# Altium schematic sheet SiLPA_HE_PA_Supply.SchDoc: SiLPA HE
size 420 x 297 mm; EDA_Number: ARTIQ; Projet: ARTIQ/SINARA; Author: S.Hanasz / G. Kasprowicz; CompanyName: WUT ISE; DrawnBy: S.Hanasz / G. Kasprowicz; Organization: WUT ISE; Address1: PW ISE; Address2: Nowowiejska 15/19 00-665 Warsaw; Address3: gkasprow@gmail.com; DocumentNumber: 5; Revision: 1; SheetNumber: 5; SheetTotal: 9; ModifiedBy: -; CheckedDate: -; Title2: PA Power supply; DivGrp: WUT ISE; Designer: S.Hanasz / G. Kasprowicz; ModifiedDate: -; ProjectName: Sensor Box
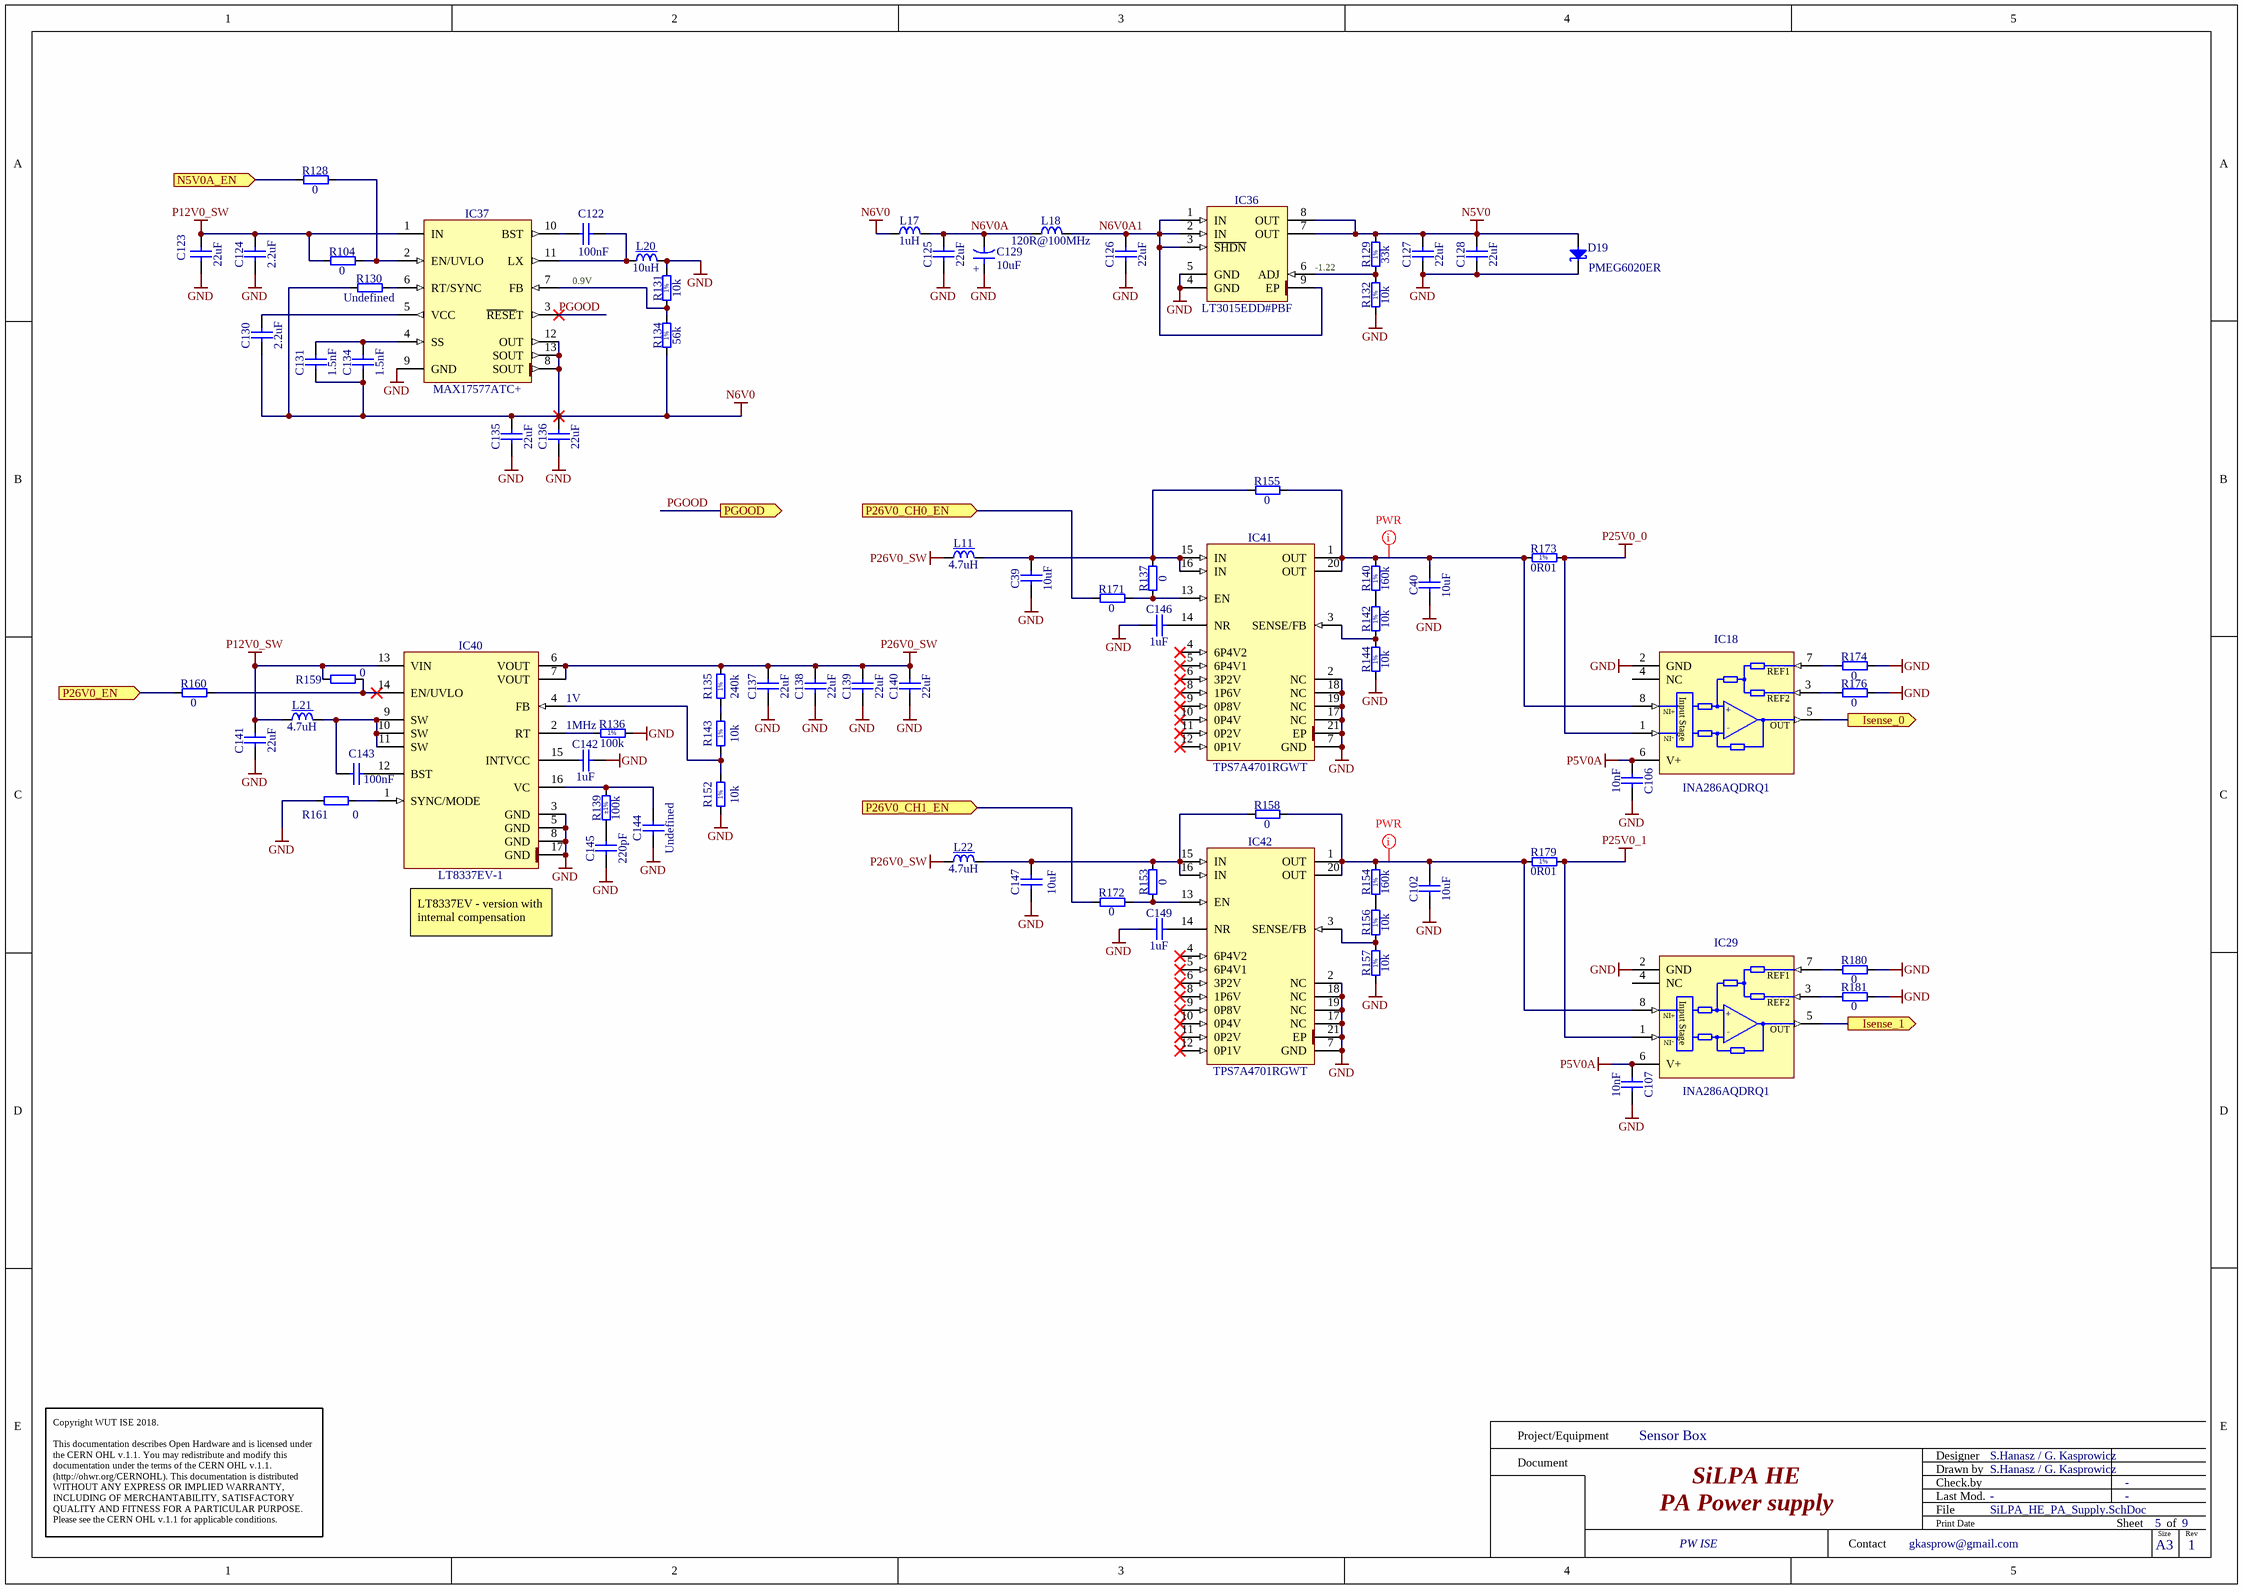
[diagram p0: SiLPA_HE_PA_Supply.SchDoc]

## Parts
C39  10uF  [CAPC3225X280N]
C40  10uF  [CAPC3225X280N]
C102  10uF  [CAPC3225X280N]
C106  10nF  [CAPC1005X55N]
C107  10nF  [CAPC1005X55N]
C122  100nF  [CAPC1005X55N]
C123  22uF  [CAPC3216X180N]
C124  2.2uF  [CAPC1608X87N]
C125  22uF  [CAPC2012X135N]
C126  22uF  [CAPC2012X135N]
C127  22uF  [CAPC2012X135N]
C128  22uF  [CAPC2012X135N]
C129  10uF  [CAPMP3216X180N]
C130  2.2uF  [CAPC1608X87N]
C131  1.5nF  [CAPC1005X55N]
C134  1.5nF  [CAPC1005X55N]
C135  22uF  [CAPC2012X135N]
C136  22uF  [CAPC2012X135N]
C137  22uF  [CAPC3216X180N]
C138  22uF  [CAPC3216X180N]
C139  22uF  [CAPC3216X180N]
C140  22uF  [CAPC3216X180N]
C141  22uF  [CAPC3216X180N]
C142  1uF  [CAPC1608X87N]
C143  100nF  [CAPC1005X55N]
C144  Undefined  [CAPC1005X55N]
C145  220pF  [CAPC1005X55N]
C146  1uF  [CAPC1608X87N]
C147  10uF  [CAPC3225X280N]
C149  1uF  [CAPC1608X87N]
D19  PMEG6020ER  [SODFL3517X110N]
IC18  INA286AQDRQ1  [SOIC127P600X175-8N]
IC29  INA286AQDRQ1  [SOIC127P600X175-8N]
IC36  LT3015EDD#PBF  [SON50P300X300X80-9N-R175X248]
IC37  MAX17577ATC+  [SON50P300X300X80-13N-R180X260]
IC40  LT8337EV-1  [ANALOG-DEVICES_LQFN(16) # 05-08-1798]
IC41  TPS7A4701RGWT  [QFN65P500X500X100-21N-S325]
IC42  TPS7A4701RGWT  [QFN65P500X500X100-21N-S325]
L11  4.7uH  [IND_WURTH_WE-SPC-4838]
L17  1uH  [INDC2620X100N]
L18  120R@100MHz  [INDC1608X65N]
L20  10uH  [IND_WURTH_WE-SPC-4838]
L21  4.7uH  [IND_WURTH_WE-SPC-4838]
L22  4.7uH  [IND_WURTH_WE-SPC-4838]
R104  0  [RESC1005X40N]
R128  0  [RESC1005X40N]
R129  33k  [RESC1005X40N]
R130  Undefined  [RESC1005X40N]
R131  10k  [RESC1005X40N]
R132  10k  [RESC1005X40N]
R134  56k  [RESC1005X40N]
R135  240k  [RESC1005X40N]
R136  100k  [RESC1005X40N]
R137  0  [RESC1608X55N]
R139  100k  Tolerance: ±1%  [RESC1005X40N]
R140  160k  [RESC1005X40N]
R142  10k  [RESC1005X40N]
R143  10k  [RESC1005X40N]
R144  10k  [RESC1005X40N]
R152  10k  [RESC1005X40N]
R153  0  [RESC1608X55N]
R154  160k  [RESC1005X40N]
R155  0  [RESC3216X65N]
R156  10k  [RESC1005X40N]
R157  10k  [RESC1005X40N]
R158  0  [RESC3216X65N]
R159  0  [RESC1005X40N]
R160  0  [RESC1005X40N]
R161  0  [RESC1005X40N]
R171  0  [RESC1608X55N]
R172  0  [RESC1608X55N]
R173  0R01  [RES_BOURNS_CFG0612]
R174  0  [RESC1005X40N]
R176  0  [RESC1005X40N]
R179  0R01  [RES_BOURNS_CFG0612]
R180  0  [RESC1005X40N]
R181  0  [RESC1005X40N]

## Ports
Isense_0 (out), Isense_1 (out), N5V0A_EN (in), P26V0_CH0_EN (in), P26V0_CH1_EN (in), P26V0_EN (in), PGOOD (out)

## Nets
GND: C39.1 C40.1 C102.1 C106.2 C107.2 C123.1 C124.1 C125.1 C126.1 C127.1 C128.1 C129.1 C135.1 C136.1 C137.1 C138.1 C139.1 C140.1 C141.1 C142.2 C144.1 C145.1 C146.1 C147.1 C149.1 D19.1(C) IC18.2(GND) IC29.2(GND) IC36.4(GND) IC36.5(GND) IC37.9(GND) IC40.3(GND) IC40.5(GND) IC40.8(GND) IC40.17(GND) IC41.2(NC) IC41.7(GND) IC41.17(NC) IC41.18(NC) IC41.19(NC) IC41.21(EP) IC42.2(NC) IC42.7(GND) IC42.17(NC) IC42.18(NC) IC42.19(NC) IC42.21(EP) L20.2 R131.2 R132.1 R136.2 R144.1 R152.1 R157.1 R161.1 R174.2 R176.2 R180.2 R181.2
N5V0: C127.2 C128.2 D19.2(A) IC36.7(OUT) IC36.8(OUT) R129.2
N6V0: C130.1 C131.1 C134.1 C135.2 C136.2 IC37.8(SOUT) IC37.12(OUT) IC37.13(SOUT) L17.1 R130.1 R134.1
P5V0A: C106.1 C107.1 IC18.6(V+) IC29.6(V+)
P12V0_SW: C123.2 C124.2 C141.2 IC37.1(IN) IC40.13(VIN) L21.1 R104.1 R159.1
P25V0_0: IC18.1(-IN) R173.2
P25V0_1: IC29.1(-IN) R179.2
P26V0_SW: C137.2 C138.2 C139.2 C140.2 IC40.6(VOUT) IC40.7(VOUT) L11.1 L22.1 R135.2
Isense_0: IC18.5(OUT) ; port Isense_0
Isense_1: IC29.5(OUT) ; port Isense_1
N5V0A_EN: R128.1 ; port N5V0A_EN
N6V0A: C125.2 C129.2 L17.2 L18.1
N6V0A1: C126.2 IC36.1(IN) IC36.2(IN) IC36.3(~{SHDN}) IC36.9(EP) L18.2
P26V0_CH0_EN: R171.1 ; port P26V0_CH0_EN
P26V0_CH1_EN: R172.1 ; port P26V0_CH1_EN
P26V0_EN: R160.1 ; port P26V0_EN
PGOOD: IC37.3(~{RESE}T) ; port PGOOD
NetC39_2: C39.2 IC41.15(IN) IC41.16(IN) L11.2 R137.2 R155.1
NetC40_2: C40.2 IC18.8(+IN) IC41.1(OUT) IC41.20(OUT) R140.2 R155.2 R173.1
NetC102_2: C102.2 IC29.8(+IN) IC42.1(OUT) IC42.20(OUT) R154.2 R158.2 R179.1
NetC122_1: C122.1 IC37.11(LX) L20.1
NetC122_2: C122.2 IC37.10(BST)
NetC130_2: C130.2 IC37.5(VCC)
NetC131_2: C131.2 C134.2 IC37.4(SS)
NetC142_1: C142.1 IC40.15(INTVCC)
NetC143_1: C143.1 IC40.12(BST)
NetC143_2: C143.2 IC40.9(SW) IC40.10(SW) IC40.11(SW) L21.2
NetC144_2: C144.2 IC40.16(VC) R139.2
NetC145_2: C145.2 R139.1
NetC146_2: C146.2 IC41.14(NR)
NetC147_2: C147.2 IC42.15(IN) IC42.16(IN) L22.2 R153.2 R158.1
NetC149_2: C149.2 IC42.14(NR)
NetIC18_3: IC18.3(REF2) R176.1
NetIC18_7: IC18.7(REF1) R174.1
NetIC29_3: IC29.3(REF2) R181.1
NetIC29_7: IC29.7(REF1) R180.1
NetIC36_6: IC36.6(ADJ) R129.1 R132.2
NetIC37_2: IC37.2(EN/UVLO) R104.2 R128.2
NetIC37_6: IC37.6(RT/SYNC) R130.2
NetIC37_7: IC37.7(FB) R131.1 R134.2
NetIC40_1: IC40.1(SYNC/MODE) R161.2
NetIC40_2: IC40.2(RT) R136.1
NetIC40_4: IC40.4(FB) R143.1 R152.2
NetIC40_14: IC40.14(EN/UVLO) R159.2 R160.2
NetIC41_3: IC41.3(SENSE/FB) R142.1 R144.2
NetIC41_13: IC41.13(EN) R137.1 R171.2
NetIC42_3: IC42.3(SENSE/FB) R156.1 R157.2
NetIC42_13: IC42.13(EN) R153.1 R172.2
NetR135_1: R135.1 R143.2
NetR140_1: R140.1 R142.2
NetR154_1: R154.1 R156.2

Not connected (* = marked no-connect by the designer): IC18 4(NC); IC29 4(NC); IC41 4(6P4V2)* 5(6P4V1)* 6(3P2V)* 8(1P6V)* 9(0P8V)* 10(0P4V)* 11(0P2V)* 12(0P1V)*; IC42 4(6P4V2)* 5(6P4V1)* 6(3P2V)* 8(1P6V)* 9(0P8V)* 10(0P4V)* 11(0P2V)* 12(0P1V)*

## Layout directives
net class PWR: NetC40_2, NetC102_2

## Notes on the sheet
- 0.9V
- -1.22
- 1V
- (near R136) 1MHz
- (near IC40) LT8337EV - version with internal compensation
- Project/Equipment
- Document
- Designer
- Drawn by
- Check.by
- Copyright WUT ISE 2018.
  This documentation describes Open Hardware and is licensed under the CERN OHL v.1.1. You may redistribute and modify this documentation under the terms of the CERN OHL v.1.1. (http://ohwr.org/CERNOHL). This documentation is distributed WITHOUT ANY EXPRESS OR IMPLIED WARRANTY, INCLUDING OF MERCHANTABILITY, SATISFACTORY QUALITY AND FITNESS FOR A PARTICULAR PURPOSE. Please see the CERN OHL v.1.1 for applicable conditions.
- Contact
- File
- Last Mod.
- Print Date
- Sheet
- Size
- A3
- of
- Rev
- (in symbol CTE3216-18_10UF_16V_20%_AVX_TCJ) +
- (in symbol INA286AQDRQ1) +; Input Stage; -
- (in symbol R0402_10K_1%_0.0625W_100PPM) 1%
- (in symbol R0402_33K_1%_0.0625W_100PPM) 1%
- (in symbol R0402_56K_1%_0.0625W_100PPM) 1%
- (in symbol R0402_100K_1%_0.0625W_100PPM) 1%
- (in symbol R0402_160K_1%_0.0625W_100PPM) 1%
- (in symbol R0402_240K_1%_0.0625W_100PPM) 1%
- (in symbol R0612_0R01_1%_1W_100PPM_BOURNS_CFG0612) 1%

## Library data of the parts
C39 C40 C102 C147 = CC1210_10UF_50V_10%_X7R_YUDEN_UMK325AB7106KMHP: Non-polarised capacitor; Part Description: SMD Multilayer Chip Ceramic Capacitor (High Dielectric Type) for Automotive / Industrial Applications; Manufacturer: TAIYO YUDEN; Voltage: 50V; TC: X7R; Tolerance: ±10%; Part Number: CC1210_10UF_50V_10%_X7R_YUDEN_UMK325AB7106KMHP; Component Kind: Standard; Component Type: Standard; Pin Count: 2; Value: 10uF; Status: Not Recommended; Manufacturer Part Number: UMK325AB7106KMHP; Case: 1210; Mounted: Yes; Socket: No; SMD: Yes; Sense: No; HelpURL: \\cern.ch\dfs\Applications\Altium\Datasheets\CC1210_TAIYO-YUDEN_UMK325AB7106KMHP.pdf; Author: CERN DEM JLC; CreateDate: 30.11.2016; LatestRevisionDate: 30.12.2015; ComponentHeight: 2.8mm
C106 C107 = CC0402_10NF_16V_10%_X7R: Non-polarised capacitor; Part Description: SMD Multilayer Chip Ceramic Capacitor; Manufacturer: GENERIC; Manufacturer1 Part Number: 223878715636; Voltage: 16V; TC: X7R; Tolerance: ±10%; Part Number: CC0402_10NF_16V_10%_X7R; Component Kind: Standard; Component Type: Standard; Pin Count: 2; Value: 10nF; Status: Not Recommended; Manufacturer Part Number: CC0402_10NF_16V_10%_X7R; Case: 0402; Mounted: Yes; Socket: No; SMD: Yes; Manufacturer1 Example: PHYCOMP; Manufacturer1 ComponentHeight: 0.55mm; HelpURL: \\cern.ch\dfs\Applications\Altium\Datasheets\CC0402_X7R_PHYCOMP.pdf; Author: CERN DEM JLC; CreateDate: 03.12.2007; LatestRevisionDate: 03.12.2007; Sense: No
C122 C143 = CC0402_100NF_16V_10%_X5R: Non-polarised capacitor; Part Description: SMD Multilayer Chip Ceramic Capacitor; Manufacturer: GENERIC; Manufacturer1 Part Number: GRM155R61C104KA88D; Voltage: 16V; TC: X5R; Tolerance: ±10%; Part Number: CC0402_100NF_16V_10%_X5R; Component Kind: Standard; Component Type: Standard; Pin Count: 2; Value: 100nF; Status: None; Manufacturer Part Number: CC0402_100NF_16V_10%_X5R; Case: 0402; Mounted: Yes; Socket: No; SMD: Yes; Sense: No; Manufacturer1 Example: MURATA; Manufacturer1 ComponentHeight: 0.55mm; HelpURL: \\cern.ch\dfs\Applications\Altium\Datasheets\CC0402_X5R_MURATA_GRM.pdf; Author: CERN DEM JLC; CreateDate: 10.12.2013; LatestRevisionDate: 10.12.2013
C123 C137-C141 = CC1206_22UF_35V_20%_JB_TDK_C3216JB1V226M160AC: Non-polarised capacitor; Part Description: SMD Multilayer Chip Ceramic Capacitor; Manufacturer: TDK; Voltage: 35V; TC: JB(±10%); Tolerance: ±20%; Part Number: CC1206_22UF_35V_20%_JB_TDK_C3216JB1V226M160AC; Component Kind: Standard; Component Type: Standard; Pin Count: 2; Value: 22uF; Status: None; Manufacturer Part Number: C3216JB1V226M160AC; Case: 1206; Mounted: Yes; Socket: No; SMD: Yes; Sense: No; HelpURL: \\cern.ch\dfs\Applications\Altium\Datasheets\CC1206_TDK_C3216JB1V226M160AC.pdf; Author: CERN DEM JLC; CreateDate: 13.07.2017; LatestRevisionDate: 13.07.2017; ComponentHeight: 1.8mm
C124 C130 = CC0603_2.2UF_16V_10%_X5R: Non-polarised capacitor; Part Description: SMD Multilayer Chip Ceramic Capacitor; Manufacturer: GENERIC; Manufacturer1 Part Number: CC0603KRX5R7BB225; Voltage: 16V; TC: X5R; Tolerance: ±10%; Part Number: CC0603_2.2UF_16V_10%_X5R; Component Kind: Standard; Component Type: Standard; Pin Count: 2; Value: 2.2uF; Status: Preferred; Manufacturer Part Number: CC0603_2.2UF_16V_10%_X5R; Case: 0603; Mounted: Yes; Socket: No; SMD: Yes; Sense: No; Manufacturer1 Example: YAGEO PHYCOMP; Manufacturer1 ComponentHeight: 0.9mm; HelpURL: \\cern.ch\dfs\Applications\Altium\Datasheets\CC0805_X5R_PHYCOMP_HC.pdf; Author: CERN DEM JLC; CreateDate: 28.04.2011; LatestRevisionDate: 28.04.2011
C125-C128 C135 C136 = CC0805_22UF_16V_10%_X5R: Non-polarised capacitor; Part Description: SMD Multilayer Chip Ceramic Capacitor; Manufacturer: GENERIC; Manufacturer1 Part Number: C2012X5R1C226KT; Voltage: 16V; TC: X5R; Tolerance: ±10%; Part Number: CC0805_22UF_16V_10%_X5R; Component Kind: Standard; Component Type: Standard; Pin Count: 2; Value: 22uF; Status: Preferred; Manufacturer Part Number: CC0805_22UF_16V_10%_X5R; Case: 0805; Mounted: Yes; Socket: No; SMD: Yes; Sense: No; Manufacturer1 Example: TDK; Manufacturer1 ComponentHeight: 1.35mm; HelpURL: \\cern.ch\dfs\Applications\Altium\Datasheets\CC0805_X5R_TDK_C.pdf; Author: CERN DEM JLC; CreateDate: 25.10.2012; LatestRevisionDate: 25.10.2012
C129 = CTE3216-18_10UF_16V_20%_AVX_TCJ: Polarised capacitor; Part Description: ESR 0R200 Tantalum Solid Electrolytic Chip Capacitor with Conductive Polymer Electrode; Manufacturer: AVX; Manufacturer Part Number: TCJA106M016R0200; Voltage: 16V; Tolerance: ±20%; Part Number: CTE3216-18_10UF_16V_20%_AVX_TCJ; Component Kind: Standard; Component Type: Standard; Pin Count: 2; Value: 10uF; Status: Preferred; Case: A; Mounted: Yes; Socket: No; SMD: Yes; Sense: No; ComponentHeight: 1.8mm; HelpURL: \\cern.ch\dfs\Applications\Altium\Datasheets\CTE_AVX_TCJ.pdf; Author: CERN DEM JLC; CreateDate: 29.03.2012; LatestRevisionDate: 29.03.2012
C131 C134 = CC0402_1.5NF_50V_5%_C0G: Non-polarised capacitor; Part Description: SMD Multilayer Chip Ceramic Capacitor; Manufacturer: GENERIC; Manufacturer1 Part Number: C0402C152J5GACTU; Voltage: 50V; TC: C0G/NP0; Tolerance: ±5%; Part Number: CC0402_1.5NF_50V_5%_C0G; Component Kind: Standard; Component Type: Standard; Pin Count: 2; Value: 1.5nF; Status: Preferred; Manufacturer Part Number: CC0402_1.5NF_50V_5%_C0G; Case: 0402; Mounted: Yes; Socket: No; SMD: Yes; Sense: No; Manufacturer1 Example: KEMET; Manufacturer1 ComponentHeight: 0.55mm; HelpURL: \\cern.ch\dfs\Applications\Altium\Datasheets\CC0402_C0G_KEMET_(Commercial Grade).pdf; Author: CERN DEM BC; CreateDate: 02.09.2019; LatestRevisionDate: 02.09.2019
C142 C146 C149 = CC0603_1UF_16V_10%_X7R: Non-polarised capacitor; Part Description: SMD Multilayer Chip Ceramic Capacitor; Manufacturer: GENERIC; Manufacturer1 Part Number: 223878615663; Voltage: 16V; TC: X7R; Tolerance: ±10%; Part Number: CC0603_1UF_16V_10%_X7R; Component Kind: Standard; Component Type: Standard; Pin Count: 2; Value: 1uF; Status: None; Case: 0603; Mounted: Yes; Socket: No; SMD: Yes; Sense: No; Manufacturer1 Example: YAGEO PHYCOMP; Manufacturer1 ComponentHeight: 0.9mm; HelpURL: \\cern.ch\dfs\Applications\Altium\Datasheets\CC0603_X7R_PHYCOMP.pdf; Author: CERN DEM JLC; CreateDate: 03.12.2007; LatestRevisionDate: 17.04.2015
  C142: Manufacturer Part Number: CC0603_1uF_16V_10%_X7R
  C146 C149: Manufacturer Part Number: CC0603_1UF_16V_10%_X7R
C144 = CC0402_NO-VALUE: Non-polarised capacitor; Part Description: Reserved Footprint For 0402(1005) Chip Ceramic Capacitor; Mounted: No; Part Number: CC0402_NO-VALUE; Component Kind: Standard; Component Type: Standard; Pin Count: 2; Value: Undefined; Status: None; Manufacturer: Undefined; Manufacturer Part Number: CC0402_NO-VALUE; Case: 0402; Socket: No; SMD: Yes; Sense: No; Manufacturer1 ComponentHeight: 0.55mm; HelpURL: Undefined; Author: CERN DEM JLC; CreateDate: 14.01.2014; LatestRevisionDate: 14.01.2014
C145 = CC0402_220PF_50V_1%_C0G: Non-polarised capacitor; Part Description: SMD Multilayer Chip Ceramic Capacitor; Manufacturer: GENERIC; Manufacturer1 Part Number: C0402C221F5GAC; Voltage: 50V; TC: C0G/NP0; Tolerance: ±1%; Part Number: CC0402_220PF_50V_1%_C0G; Component Kind: Standard; Component Type: Standard; Pin Count: 2; Value: 220pF; Status: Preferred; Manufacturer Part Number: CC0402_220PF_50V_1%_C0G; Case: 0402; Mounted: Yes; Socket: No; SMD: Yes; Sense: No; Manufacturer1 Example: KEMET; Manufacturer1 ComponentHeight: 0.55mm; HelpURL: \\cern.ch\dfs\Applications\Altium\Datasheets\CC0402_C0G_KEMET_(Commercial Grade).pdf; Author: CERN DEM BC; CreateDate: 14.07.2020; LatestRevisionDate: 14.07.2020
D19 = PMEG6020ER: Schottky Diode; Part Description: MEGA Schottky Barrier Rectifier; Manufacturer: NXP SEMICONDUCTORS; Voltage: 60V; Power: 2A; PressFit: No; Bonding: No; Part Number: PMEG6020ER; Component Kind: Standard; Component Type: Standard; Device: PMEG6020ER; PackageDescription: SODFL Diode (SOD123W); 2.60mm W X 1.70mm L X 1.10mm H body, IPC Medium Density; Manufacturer Part Number: PMEG6020ER; Pin Count: 2; Case: SOD123; Mounted: Yes; Socket: No; SMD: Yes; Sense: No; ComponentHeight: 0.65mm; HelpURL: \\cern.ch\dfs\Applications\Altium\Datasheets\PMEG6020ER.pdf; Author: CERN DEM JMW; CreateDate: 19.06.2014; LatestRevisionDate: 19.06.2014
IC18 IC29 = INA286AQDRQ1: 80V, Bi-Directional, Low-/High-Side, Voltage Output Current Sense Amplifier; Part Description: 80V, Bi-Directional, Low-/High-Side, Voltage Output Current Sense Amplifier (Automotive Grade); Manufacturer: TEXAS INSTRUMENTS; PressFit: No; Bonding: No; Part Number: INA286AQDRQ1; Component Kind: Standard; Component Type: Standard; Device: INA286AQDRQ1; PackageDescription: SOIC 8, Pitch 1.27mm, Body 4x5mm, IPC Medium Density; Manufacturer Part Number: INA286AQDRQ1; Pin Count: 8; Case: SOIC8; Mounted: Yes; Socket: No; SMD: Yes; Sense: No; ComponentHeight: 1.75mm; Author: CERN DEM JLC; HelpURL: \\cern.ch\dfs\Applications\Altium\Datasheets\INA286AQDRQ1.pdf; CreateDate: 27.09.2018; LatestRevisionDate: 27.09.2018
IC36 = LT3015EDD#PBF: 1.5A, Low Noise, Negative Linear Regulator with Precision Current Limit; Part Description: –1.22V to –29.3V, 1.5A, Low Noise, Negative Linear Regulator with Precision Current Limit; Manufacturer: LINEAR TECHNOLOGY; PressFit: No; Bonding: No; Part Number: LT3015EDD#PBF; Component Kind: Standard; Component Type: Standard; Device: LT3015EDD#PBF; PackageDescription: SON, (DFN) 0.50mm,pitch; 8 pin,3.00mm W X 3.00mm L X 0.80mm H body (w/thermal tab 1.75 X2.48mm), IPC Medium Density; Manufacturer Part Number: LT3015EDD#PBF; Pin Count: 9; Case: SON8; Mounted: Yes; Socket: No; SMD: Yes; Sense: No; ComponentHeight: 0.8mm; HelpURL: \\cern.ch\dfs\Applications\Altium\Datasheets\LT3015EDD#PBF.pdf; Author: CERN DEM MR; CreateDate: 10.02.2016; LatestRevisionDate: 10.02.2016
IC37 = MAX17577ATC+: 4.5V to 60V, 1A High-Efficiency, Synchronous, Inverting Output DC-DC Converters; Manufacturer: MAXIM; PressFit: No; Bonding: No; Part Number: MAX17577ATC+; Component Kind: Standard; Component Type: Standard; Device: MAX17577ATC+; PackageDescription: SON, 0.50mm Pitch, 12-Pin, 3.00mm W  X 3.00mm L X 0.80mm H body, (w/Thermal Tab 1.80 X 2.60mm), IPC Medium Density; Part Description: 4.5V to 60V, 1A High-Efficiency, Synchronous, Inverting Output DC-DC Converters; Manufacturer Part Number: MAX17577ATC+; Pin Count: 13; Case: SON12; Mounted: Yes; Socket: No; SMD: Yes; Sense: No; ComponentHeight: 0.8mm; HelpURL: \\cern.ch\dfs\Applications\Altium\Datasheets\MAX17577ATC+.pdf; Author: CERN DEM HF; CreateDate: 22.10.2021; LatestRevisionDate: 22.10.2021
IC40 = LT8337EV-1: 28V, 5A Low IQ Synchronous Step-Up Silent Switcher with PassThru; Manufacturer: ANALOG DEVICES; PressFit: No; Bonding: No; Part Number: LT8337EV-1; Component Kind: Standard; Component Type: Standard; Device: LT8337EV-1; PackageDescription: LQFN, 16-Lead, 0.50mm Pitch; 3.50mm W X 3.50mm L X 0.83mm H body (with 4 Tab 0.375 X0.375mm and with a Thermal Tab 1.43 X1.43mm)# 05-08-1798; Part Description: 28V, 5A Low IQ Synchronous Step-Up Silent Switcher with PassThru; Manufacturer Part Number: LT8337EV-1; Pin Count: 21; Case: QFN16; Mounted: Yes; Socket: No; SMD: Yes; Sense: No; ComponentHeight: 1.03mm; HelpURL: \\cern.ch\dfs\Applications\Altium\Datasheets\LT8337.pdf; Author: CERN DEM HF; CreateDate: 07.09.2022; LatestRevisionDate: 07.09.2022
IC41 IC42 = TPS7A4701RGWT: Low Noise (3uVrms), 1A, High Voltage Low-Dropout Linear Regulator; Part Description: 1.4V to 34V, 1A, Low Noise (4uVrms), Low-Dropout Adjustable Voltage Regulator; Manufacturer: TEXAS INSTRUMENTS; PressFit: No; Bonding: No; Part Number: TPS7A4701RGWT; Component Kind: Standard; Component Type: Standard; Device: TPS7A4701RGWT; PackageDescription: QFN, 0.65mm pitch, Square; 20 Pin, 5.00mm L X 5.00mm W X 1.00mm H body (w/Thermal Tab 3.25 X 3.25mm), IPC Medium Density; Manufacturer Part Number: TPS7A4701RGWT; Pin Count: 21; Case: QFN20; Mounted: Yes; Socket: No; SMD: Yes; Sense: No; ComponentHeight: 1mm; HelpURL: \\cern.ch\dfs\Applications\Altium\Datasheets\TPS7A4701RGWT.pdf; Author: CERN DEM MR; CreateDate: 30.06.2017; LatestRevisionDate: 06.07.2017
L11 L21 L22 = IND_4.7UH_20%_WURTH_WE-SPC_74408943047: Inductor With Core; Part Description: SMD Shielded Power Inductor (WE-SPC Series); Manufacturer: WURTH ELEKTRONIK; Power: 2.2A; Resistance: 0.045R; Tolerance: ±20%; Part Number: IND_4.7UH_20%_WURTH_WE-SPC_74408943047; Component Kind: Standard; Component Type: Standard; Pin Count: 2; Value: 4.7uH; Status: None; Manufacturer Part Number: 74408943047; Mounted: Yes; Socket: No; SMD: Yes; Sense: No; ComponentHeight: 4.1mm; HelpURL: \\cern.ch\dfs\Applications\Altium\Datasheets\IND_WURTH_WE-SPC_74408943047.pdf; Author: CERN DEM JLC; CreateDate: 24.11.2014; LatestRevisionDate: 05.07.2017
L17 = IND1008_1UH_20%_WURTH_74479787210B: Inductor; Part Description: Power Multilayer Inductor (WE-PMI Series); Manufacturer: WURTH ELEKTRONIK; Power: 1.95A; Resistance: 0.06R; Tolerance: ±20%; Part Number: IND1008_1UH_20%_WURTH_74479787210B; Component Kind: Standard; Component Type: Standard; Pin Count: 2; Value: 1uH; Status: None; Manufacturer Part Number: 74479787210B; Mounted: Yes; Socket: No; SMD: Yes; Sense: No; ComponentHeight: 1mm; HelpURL: \\cern.ch\dfs\Applications\Altium\Datasheets\IND_WURTH_WE-PMI_74479787210B.pdf; Author: CERN DEM JLC; CreateDate: 01.10.2014; LatestRevisionDate: 01.10.2014; Case: 1008
L18 = IND0603_MURATA_BLM18SG121TN1D: Inductor; Part Description: SMD EMIFIL Suppression Chip Ferrite Bead; Manufacturer: MURATA; Power: 3A; Resistance: 0.025R; Tolerance: ±25%; Part Number: IND0603_MURATA_BLM18SG121TN1D; Component Kind: Standard; Component Type: Standard; Pin Count: 2; Value: 120R@100MHz; Status: None; Manufacturer Part Number: BLM18SG121TN1D; Case: 0603; Mounted: Yes; Socket: No; SMD: Yes; Sense: No; ComponentHeight: 0.65mm; HelpURL: \\cern.ch\dfs\Applications\Altium\Datasheets\IND0603_MURATA_BLM18S.pdf; Author: CERN DEM JLC; CreateDate: 23.07.2014; LatestRevisionDate: 23.07.2014
L20 = IND_10UH_20%_WURTH_WE-SPC_74408943100: Inductor With Core; Part Description: SMD Shielded Power Inductor (WE-SPC Series); Manufacturer: WURTH ELEKTRONIK; Power: 1.65A; Resistance: 0.082R; Tolerance: ±20%; Part Number: IND_10UH_20%_WURTH_WE-SPC_74408943100; Component Kind: Standard; Component Type: Standard; Pin Count: 2; Value: 10uH; Status: None; Manufacturer Part Number: 74408943100; Mounted: Yes; Socket: No; SMD: Yes; Sense: No; ComponentHeight: 4.1mm; HelpURL: \\cern.ch\dfs\Applications\Altium\Datasheets\IND_WURTH_WE-SPC_74408943100.pdf; Author: CERN DEM MR; CreateDate: 30.06.2017; LatestRevisionDate: 05.07.2017
R104 R128 = R0402_0R_JUMPER: Resistor; Part Description: 1A (0.05R Max DC Resistance) Zero Ohm Jumper; Manufacturer: GENERIC; Manufacturer1 Part Number: 232270591001L; Part Number: R0402_0R_JUMPER; Component Kind: Standard; Component Type: Standard; Pin Count: 2; Value: 0; Status: Not recommended; Manufacturer Part Number: R0402_0R_JUMPER; Case: 0402; Mounted: Yes; Sense: No; Socket: No; SMD: Yes; Manufacturer1 Example: YAGEO PHYCOMP; Manufacturer1 ComponentHeight: 0.4mm; HelpURL: \\cern.ch\dfs\Applications\Altium\Datasheets\R0402_Phycomp_RC0402.pdf; Author: CERN DEM JLC; CreateDate: 03.12.2007; LatestRevisionDate: 17.10.2012
R129 = R0402_33K_1%_0.0625W_100PPM: Resistor - 1%; Part Description: General Purpose Thick Film Chip Resistor; Manufacturer: GENERIC; Manufacturer1 Part Number: 232270673303L; TC: ±100ppm/°C; PressFit: No; Tolerance: ±1%; Part Number: R0402_33K_1%_0.0625W_100PPM; Component Kind: Standard; Component Type: Standard; Pin Count: 2; Value: 33k; Status: Not Recommended; Power: 0.0625W; Manufacturer Part Number: R0402_33K_1%_0.0625W_100PPM; Case: 0402; Mounted: Yes; Sense: No; Socket: No; SMD: Yes; Manufacturer1 Example: YAGEO PHYCOMP; Manufacturer1 ComponentHeight: 0.4mm; HelpURL: \\cern.ch\dfs\Applications\Altium\Datasheets\R0402_Phycomp_RC0402.pdf; Author: CERN DEM JLC; CreateDate: 03.12.2007; LatestRevisionDate: 17.10.2012
R130 = R0402_NO-VALUE: Resistor; Part Description: Reserved Footprint For a 0402 (1005) Chip Resistor; PressFit: No; Mounted: No; Part Number: R0402_NO-VALUE; Component Kind: Standard; Component Type: Standard; Pin Count: 2; Value: Undefined; Status: None; Manufacturer: Undefined; Manufacturer Part Number: R0402_NO-VALUE; Case: 0402; Sense: No; Socket: No; SMD: Yes; Manufacturer1 Example: Undefined; Manufacturer1 Part Number: Undefined; Manufacturer1 ComponentHeight: Undefined; HelpURL: Undefined; Author: CERN DEM JLC; CreateDate: 03.12.2007; LatestRevisionDate: 13.03.2008
R131 R132 R142-R144 R152 R156 R157 = R0402_10K_1%_0.0625W_100PPM: Resistor - 1%; Part Description: General Purpose Thick Film Chip Resistor; Manufacturer: GENERIC; Manufacturer1 Part Number: 232270671003L; TC: ±100ppm/°C; PressFit: No; Tolerance: ±1%; Part Number: R0402_10K_1%_0.0625W_100PPM; Component Kind: Standard; Component Type: Standard; Pin Count: 2; Value: 10k; Status: Not Recommended; Power: 0.0625W; Manufacturer Part Number: R0402_10K_1%_0.0625W_100PPM; Case: 0402; Mounted: Yes; Sense: No; Socket: No; SMD: Yes; Manufacturer1 Example: YAGEO PHYCOMP; Manufacturer1 ComponentHeight: 0.4mm; HelpURL: \\cern.ch\dfs\Applications\Altium\Datasheets\R0402_Phycomp_RC0402.pdf; Author: CERN DEM JLC; CreateDate: 03.12.2007; LatestRevisionDate: 17.10.2012
R134 = R0402_56K_1%_0.0625W_100PPM: Resistor - 1%; Part Description: General Purpose Thick Film Chip Resistor; Manufacturer: GENERIC; Manufacturer1 Part Number: 232270675603L; TC: ±100ppm/°C; PressFit: No; Tolerance: ±1%; Part Number: R0402_56K_1%_0.0625W_100PPM; Component Kind: Standard; Component Type: Standard; Pin Count: 2; Value: 56k; Status: Not Recommended; Power: 0.0625W; Manufacturer Part Number: R0402_56K_1%_0.0625W_100PPM; Case: 0402; Mounted: Yes; Sense: No; Socket: No; SMD: Yes; Manufacturer1 Example: YAGEO PHYCOMP; Manufacturer1 ComponentHeight: 0.4mm; HelpURL: \\cern.ch\dfs\Applications\Altium\Datasheets\R0402_Phycomp_RC0402.pdf; Author: CERN DEM JLC; CreateDate: 03.12.2007; LatestRevisionDate: 17.10.2012
R135 = R0402_240K_1%_0.0625W_100PPM: Resistor - 1%; Part Description: General Purpose Thick Film Chip Resistor; Manufacturer: GENERIC; Manufacturer1 Part Number: 232270672404L; TC: ±100ppm/°C; PressFit: No; Tolerance: ±1%; Part Number: R0402_240K_1%_0.0625W_100PPM; Component Kind: Standard; Component Type: Standard; Pin Count: 2; Value: 240k; Status: Not Recommended; Power: 0.0625W; Manufacturer Part Number: R0402_240K_1%_0.0625W_100PPM; Case: 0402; Mounted: Yes; Sense: No; Socket: No; SMD: Yes; Manufacturer1 Example: YAGEO PHYCOMP; Manufacturer1 ComponentHeight: 0.4mm; HelpURL: \\cern.ch\dfs\Applications\Altium\Datasheets\R0402_Phycomp_RC0402.pdf; Author: CERN DEM JLC; CreateDate: 03.12.2007; LatestRevisionDate: 17.10.2012
R136 R139 = R0402_100K_1%_0.0625W_100PPM: Resistor - 1%; Part Description: General Purpose Thick Film Chip Resistor; Manufacturer: GENERIC; Manufacturer1 Part Number: 232270671004L; TC: ±100ppm/°C; PressFit: No; Part Number: R0402_100K_1%_0.0625W_100PPM; Component Kind: Standard; Component Type: Standard; Pin Count: 2; Value: 100k; Status: Not Recommended; Power: 0.0625W; Manufacturer Part Number: R0402_100K_1%_0.0625W_100PPM; Case: 0402; Mounted: Yes; Sense: No; Socket: No; SMD: Yes; Manufacturer1 Example: YAGEO PHYCOMP; Manufacturer1 ComponentHeight: 0.4mm; HelpURL: \\cern.ch\dfs\Applications\Altium\Datasheets\R0402_Phycomp_RC0402.pdf; Author: CERN DEM JLC; CreateDate: 03.12.2007; LatestRevisionDate: 17.10.2012
  R136: Tolerance: ±1%
R137 R153 R171 R172 = R0603_0R_JUMPER: Resistor; Part Description: 1A (0.05R Max DC Resistance) Zero Ohm Jumper; Manufacturer: GENERIC; Manufacturer1 Part Number: NRC06Z0; PressFit: No; Part Number: R0603_0R_JUMPER; Component Kind: Standard; Component Type: Standard; Pin Count: 2; Value: 0; Status: Preferred; Manufacturer Part Number: R0603_0R_JUMPER; Case: 0603; Mounted: Yes; Sense: No; Socket: No; SMD: Yes; Manufacturer1 Example: NIC COMPONENT; Manufacturer1 ComponentHeight: 0.55mm; HelpURL: \\cern.ch\dfs\Applications\Altium\Datasheets\R0603_NIC_NRC.pdf; Author: CERN DEM JLC; CreateDate: 03.12.2007; LatestRevisionDate: 13.03.2008
R140 R154 = R0402_160K_1%_0.0625W_100PPM: Resistor - 1%; Part Description: General Purpose Thick Film Chip Resistor; Manufacturer: GENERIC; Manufacturer1 Part Number: 232270671604L; TC: ±100ppm/°C; PressFit: No; Part Number: R0402_160K_1%_0.0625W_100PPM; Component Kind: Standard; Component Type: Standard; Pin Count: 2; Value: 160k; Status: Not Recommended; Power: 0.0625W; Tolerance: ±1%; Manufacturer Part Number: R0402_160K_1%_0.0625W_100PPM; Case: 0402; Mounted: Yes; Sense: No; Socket: No; SMD: Yes; Manufacturer1 Example: YAGEO PHYCOMP; Manufacturer1 ComponentHeight: 0.4mm; HelpURL: \\cern.ch\dfs\Applications\Altium\Datasheets\R0402_Phycomp_RC0402.pdf; Author: CERN DEM JLC; CreateDate: 03.12.2007; LatestRevisionDate: 17.10.2012
R155 R158 = R1206_0R_JUMPER: Resistor; Part Description: 2A (0.05R Max DC Resistance) Zero Ohm Jumper; Manufacturer: GENERIC; Manufacturer1 Part Number: NRC12Z0; PressFit: No; Part Number: R1206_0R_JUMPER; Component Kind: Standard; Component Type: Standard; Pin Count: 2; Value: 0; Status: Preferred; Manufacturer Part Number: R1206_0R_JUMPER; Case: 1206; Mounted: Yes; Sense: No; Socket: No; SMD: Yes; Manufacturer1 Example: NIC COMPONENT; Manufacturer1 ComponentHeight: 0.65mm; HelpURL: \\cern.ch\dfs\Applications\Altium\Datasheets\R1206_NIC_NRC.pdf; Author: CERN DEM JLC; CreateDate: 03.12.2007; LatestRevisionDate: 13.03.2008
R159-R161 R174 R176 R180 R181 = R0402_0R_JUMPER: Resistor; Part Description: 1A (0.05R Max DC Resistance) Zero Ohm Jumper; Manufacturer: GENERIC; Manufacturer1 Part Number: 232270591001L; PressFit: No; Part Number: R0402_0R_JUMPER; Component Kind: Standard; Component Type: Standard; Pin Count: 2; Value: 0; Status: Not Recommended; Manufacturer Part Number: R0402_0R_JUMPER; Case: 0402; Mounted: Yes; Sense: No; Socket: No; SMD: Yes; Manufacturer1 Example: YAGEO PHYCOMP; Manufacturer1 ComponentHeight: 0.4mm; HelpURL: \\cern.ch\dfs\Applications\Altium\Datasheets\R0402_Phycomp_RC0402.pdf; Author: CERN DEM JLC; CreateDate: 03.12.2007; LatestRevisionDate: 17.10.2012
R173 R179 = R0612_0R01_1%_1W_100PPM_BOURNS_CFG0612: Resistor - 1%; Part Description: Metal Foil, Wide Terminal Current Sense Resistor (CFG Serie); Manufacturer: BOURNS; Manufacturer Part Number: CFG0612-FX-R010; Power: 1W; TC: ±100ppm/°C; PressFit: No; Part Number: R0612_0R01_1%_1W_100PPM_BOURNS_CFG0612; Component Kind: Standard; Component Type: Standard; Pin Count: 2; Value: 0R01; Status: Not Recommended; Tolerance: ±1%; Case: 0612; Mounted: Yes; Sense: No; Socket: No; SMD: Yes; ComponentHeight: 0.9mm; HelpURL: \\cern.ch\dfs\Applications\Altium\Datasheets\R0612_BOURNS_CFG0612.pdf; Author: CERN DEM BC; CreateDate: 17.12.2019; LatestRevisionDate: 17.12.2019